# EAGLE design 28vdcEagle (EAGLE 9.6.1)
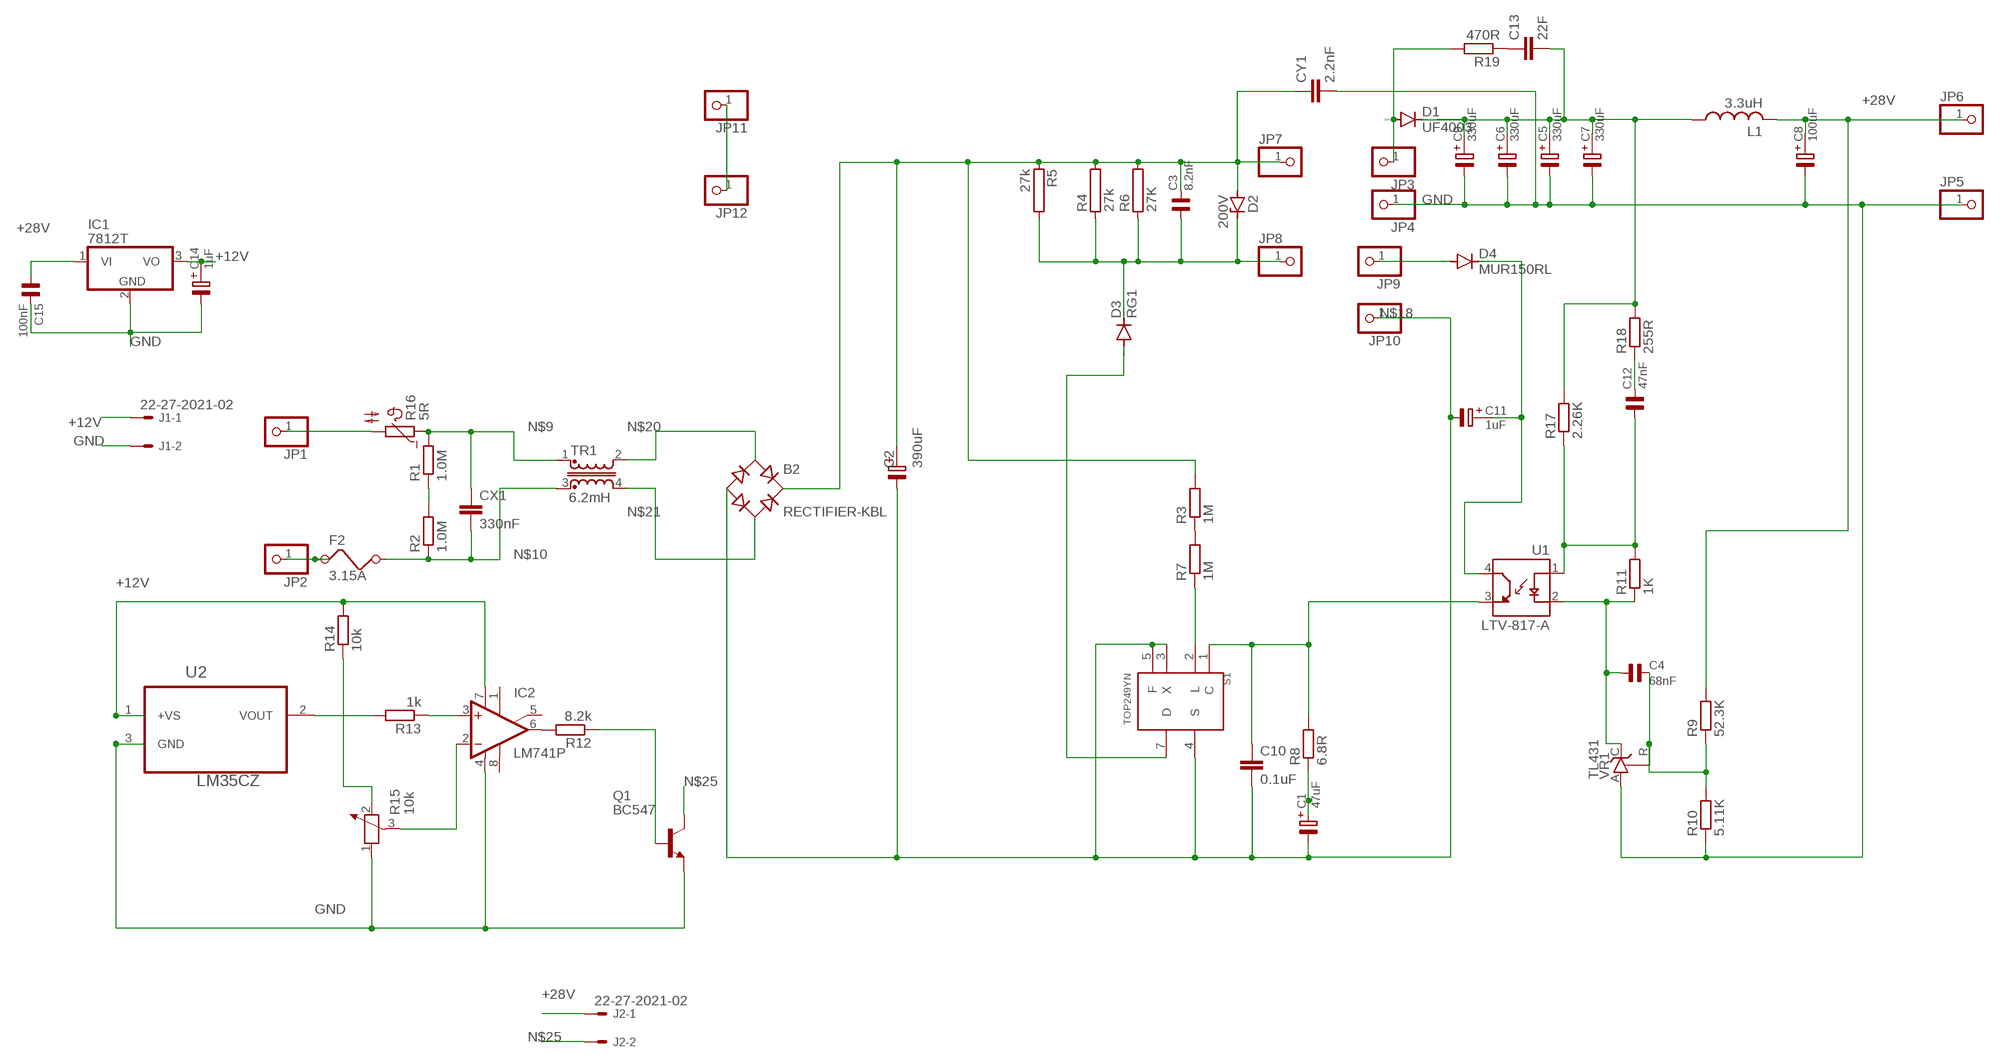
[diagram p0: schematic, sheet 1]

## Parts
B2  RECTIFIER-KBL  [KBL]
C1  47uF  E1,0-3  [E1,0-3]
C2  390uF  E3,5-10  [E3,5-10]
C3  8.2nF  C14,5  [C14,5]
C4  68nF  C2,5  [C2,5]
C5  330uF  E2,0-5  [E2,0-5]
C6  330uF  E2,0-5  [E2,0-5]
C7  330uF  E2,0-5  [E2,0-5]
C8  100uF  E2,0-5  [E2,0-5]
C9  330uF  E2,0-5  [E2,0-5]
C10  0.1uF  C-EU025-030X050  [C025-030X050]
C11  1uF  E1,0-3  [E1,0-3]
C12  47nF  C2,5  [C2,5]
C13  22F  C-EU025-030X050  [C025-030X050]
C14  1uF  E1,0-3  [E1,0-3]
C15  100nF  C2,5  [C2,5]
CX1  330nF  CXXC15B10  [XC15B10]
CY1  2.2nF  CYYC7B5  [YC7B5]
D1  UF4003  [DO41-10]
D2  200V  ZENER-DIODEC1702-15  [C1702-15]
D3  RG1  [DO204-10]
D4  MUR150RL  [DO41-10]
F2  3.15A  FUSE  [FUSE]
IC1  7812T  [TO220H]
IC2  LM741P  [DIL08]
J1  22-27-2021-02  [6410-02]
J2  22-27-2021-02  [6410-02]
JP1  PINHD-1X1  [1X01]
JP2  PINHD-1X1  [1X01]
JP3  PINHD-1X1  [1X01]
JP4  PINHD-1X1  [1X01]
JP5  PINHD-1X1  [1X01]
JP6  PINHD-1X1  [1X01]
JP7  PINHD-1X1  [1X01]
JP8  PINHD-1X1  [1X01]
JP9  PINHD-1X1  [1X01]
JP10  PINHD-1X1  [1X01]
JP11  PINHD-1X1  [1X01]
JP12  PINHD-1X1  [1X01]
L1  3.3uH  L-US0207/10  [0207/10]
Q1  BC547  [TO92]
R1  1.0M  R-EU_0207/10  [0207/10]
R2  1.0M  R-EU_0207/10  [0207/10]
R3  1M  R-EU_0207/10  [0207/10]
R4  27k  RKP290  [KP290]
R5  27k  RKP290  [KP290]
R6  27K  RKP290  [KP290]
R7  1M  R-EU_0207/10  [0207/10]
R8  6.8R  R-EU_0207/10  [0207/10]
R9  52.3K  R-EU_0207/10  [0207/10]
R10  5.11K  R-EU_0207/10  [0207/10]
R11  1K  R-EU_0207/10  [0207/10]
R12  8.2k  R-EU_0207/10  [0207/10]
R13  1k  R-EU_0207/10  [0207/10]
R14  10k  R-EU_0207/10  [0207/10]
R15  10k  POTENTIOMETER_PT-10  [PT-10]
R16  5R  B57164  [B57164]
R17  2.26K  R-EU_0207/10  [0207/10]
R18  255R  R-EU_0207/10  [0207/10]
R19  470R  R-EU_0207/10  [0207/10]
S1  TOP249YN  [TO127P470X1029X2061-7P]
TR1  6.2mH  U15-TRANSFORMER  [U15]
U1  LTV-817-A  [DIP762W50P254L510H500Q4]
U2  LM35CZ  [TO127P254X495-3P]
VR1  TL431  TL431CLP  [TO92-CLP]

## Nets
+12V: C14.+ IC1.3(VO) IC2.7(V+) J1.1 R14.2 U2.1(+VS)
+28V: C8.+ C15.1 IC1.1(VI) J2.1 JP6.1 L1.2 R9.2
GND: C5.- C6.- C7.- C8.- C9.- C14.- C15.2 CY1.2 IC1.2(GND) IC2.4(V-) J1.2 JP4.1 JP5.1 Q1.1(E) R10.1 R15.1 U2.3(GND) VR1.A
N$1: R1.1 R2.2
N$2: B2.+ C2.+ C3.2 CY1.1 D2.A JP7.1 R3.2 R4.2 R5.1 R6.2
N$3: C11.+ D4.C U1.4(CT)
N$4: R3.1 R7.2
N$5: R7.1 S1.2(L)
N$6: IC2.6(OUT) R12.2
N$7: D3.A S1.7(D)
N$8: C3.1 D2.C D3.C JP8.1 R4.1 R5.2 R6.1
N$9: CX1.1 R1.2 R16.1 TR1.1
N$10: CX1.2 F2.2 R2.1 TR1.3
N$11: C4.2 R9.1 R10.2 VR1.R
N$12: C4.1 R11.1 U1.2(C) VR1.C
N$13: C12.1 R11.2 R17.1 U1.1(A)
N$14: C5.+ C6.+ C7.+ C9.+ C13.2 D1.C L1.1 R17.2 R18.2
N$15: JP11.1 JP12.1
N$16: C13.1 R19.1
N$17: C10.1 R8.2 S1.1(C) U1.3(ET)
N$18: B2.- C1.- C2.- C10.2 C11.- JP10.1 S1.3(X) S1.4(S) S1.5(F)
N$19: D4.A JP9.1
N$20: B2.AC1 TR1.2
N$21: B2.AC2 TR1.4
N$23: R13.2 U2.2(VOUT)
N$24: Q1.2(B) R12.1
N$25: J2.2 Q1.3(C)
N$26: IC2.3(+IN) R13.1
N$27: JP1.1 R16.2
N$28: R14.1 R15.2
N$29: IC2.2(-IN) R15.3
N$31: C1.+ R8.1
N$32: C12.2 R18.1
N$33: D1.A JP3.1 R19.2
N$34: F2.1 JP2.1
Unconnected: IC2.1(ON1) IC2.5(ON2) IC2.8(OPT)

## Library data of the parts
B2 = rectifier:RECTIFIER-: Rectifier
C1 C11 C14 = cap-pan:E1,0-3
C2 = cap-pan:E3,5-10
C3 = cap-pan:C14,5
C4 C12 C15 = cap-pan:C2,5
C5-C9 = cap-pan:E2,0-5
C10 C13 = rcl:C-EU: CAPACITOR, European symbol; SPICEPREFIX: C
CX1 = rcl:CX: X CAPACITOR for power line; SPICEPREFIX: C
CY1 = rcl:CY: Y CAPACITOR for power line; SPICEPREFIX: C
D1 = diode:UF4003: DIODE ultrafast recovery diode, 200 V rectifier
D2 = diode:ZENER-DIODE: Z-Diode
D3 = diode:RG1: DIODE
D4 = diode:MUR150RL: DIODE
F2 = special:FUSE: FUSE 5 x 20 mm
IC1 = linear:78*: Positive VOLTAGE REGULATOR Source: http://cache.national.com/ds/LM/LM78L05.pdf http://www.fairchildsemi.com/ds/LM/LM7805.pdf
IC2 = linear:*741: OP AMP
J1 J2 = con-molex:22-?-02: CONNECTOR wire to board 2.54 mm (.1 inch) pitch header; MF: MOLEX; OC_FARNELL: unknown; OC_NEWARK: unknown
JP1-JP12 = pinhead:PINHD-1X1: PIN HEADER
L1 = rcl:L-US: INDUCTOR, American symbol; SPICEPREFIX: L
Q1 = transistor-npn:BC547*: NPN Transistor
R1-R3 R7-R14 R17-R19 = rcl:R-EU_: RESISTOR, European symbol; SPICEPREFIX: R
R4-R6 = resistor-power:R: Power Resitor; OC_FARNELL: unknown; OC_NEWARK: unknown
R15 = rcl:POTENTIOMETER_: Potentiometer; SPICEMODEL: POT; SPICEPREFIX: X
R16 = ptc-ntc:B57164: SIEMENS NTC; MPN: B57164K474K52; OC_FARNELL: 9753451; OC_NEWARK: 29M3118
S1 = TOP249YN:TOP249YN: Power Management, switch, AC - DC Converters, Semiconductors and Actives, line, ic; DESCRIPTION: Converter Offline Flyback Topology 66kHz ~ 132kHz TO-220-7C; DIGI-KEY_PART_NUMBER: 596-1080-5-ND; MF: Power Integrations; MP: TOP249YN; PACKAGE: TO-220 Power Integrations
TR1 = inductor-neosid:U15: TRANSFORMER U15; OC_FARNELL: unknown; OC_NEWARK: unknown
U1 = LTV-817-A (1):LTV-817-A: OPTOISOLATR 5KV TRANSISTOR 4-DIP; AVAILABILITY: Unavailable; DESCRIPTION: Optoisolator Transistor Output 5000Vrms 1 Channel 4-DIP; MF: Lite-On Inc.; MP: LTV-817-A; PACKAGE: DIP-4 Lite-On Inc.; PRICE: None
U2 = LM35CZ (1):LM35CZ: IC, TEMPERATURE SENSOR, ± 0.4°C Buy Part <https://snapeda.com/parts/LM35CZ/Texas%20Instruments/view-part/?ref=eda>; AVAILABILITY: Warning; DESCRIPTION: Temperature Sensor Analog, Local -40°C ~ 110°C 10mV/°C TO-92-3; DIGIKEY-PURCHASE-URL: https://snapeda.com/shop?store=DigiKey&id=1038505; MF: Texas Instruments; MP: LM35CZ; PACKAGE: TO-226-3 Texas Instruments; PRICE: None
VR1 = v-reg:TL431CLP: VOLTAGE REGULATOR

## Board
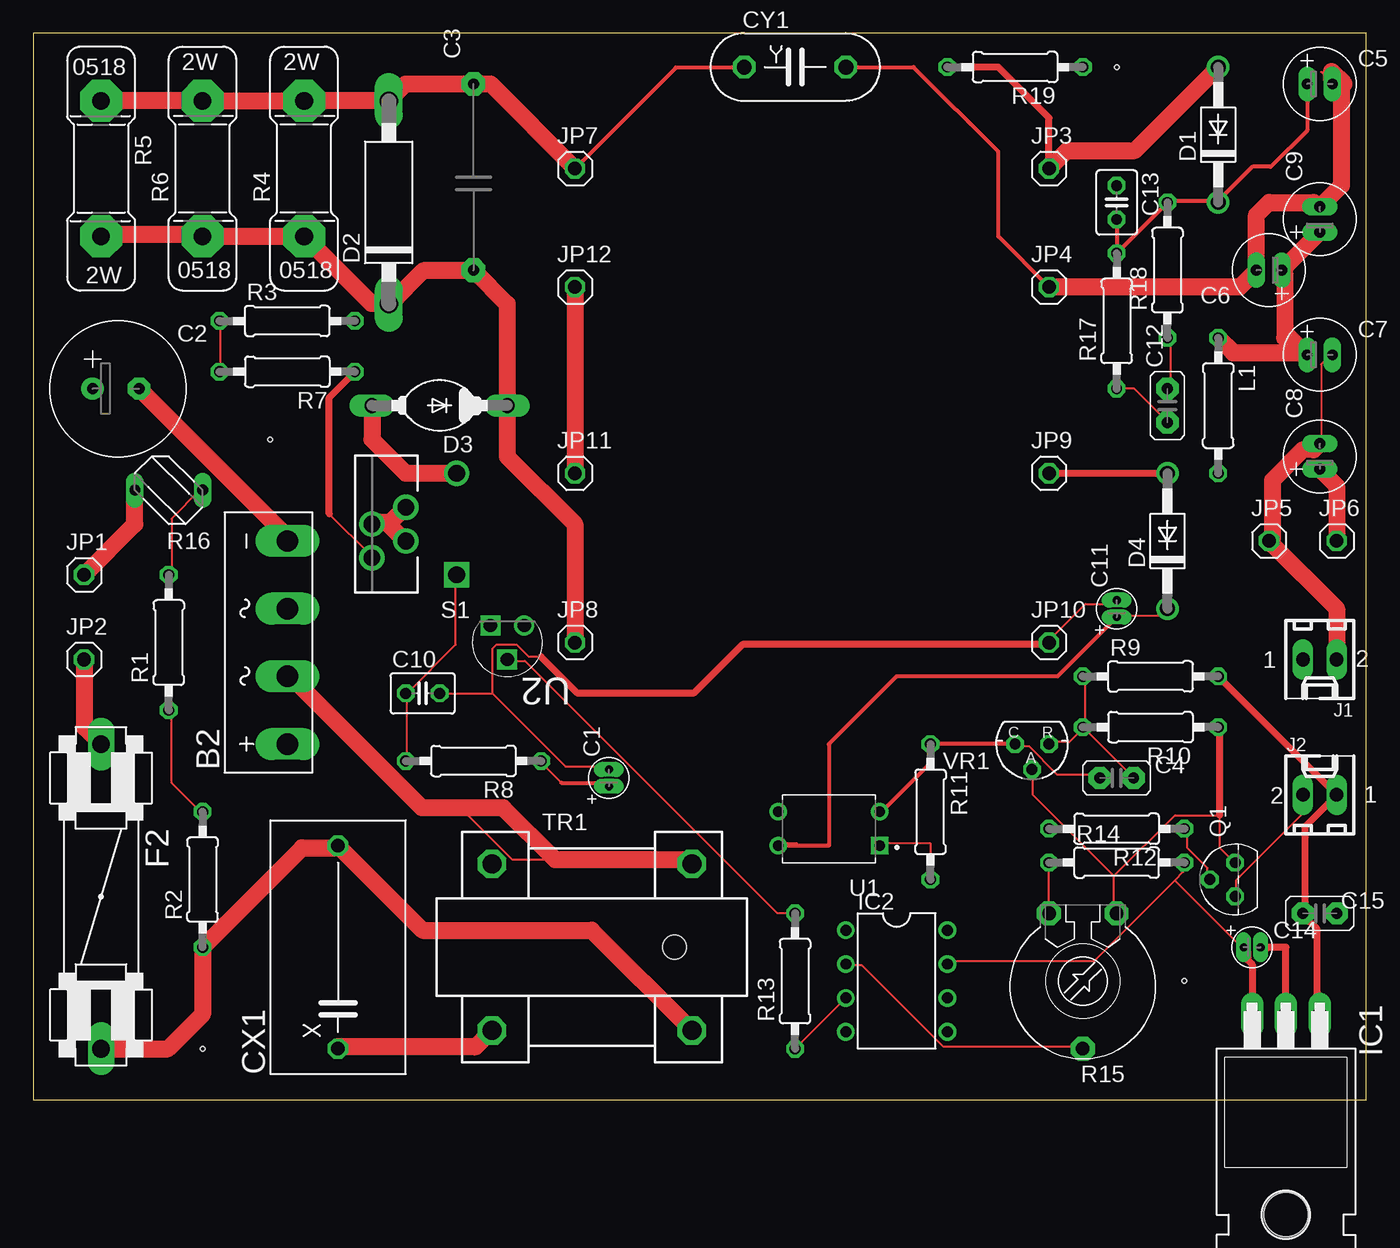
[diagram p1: board, top side]
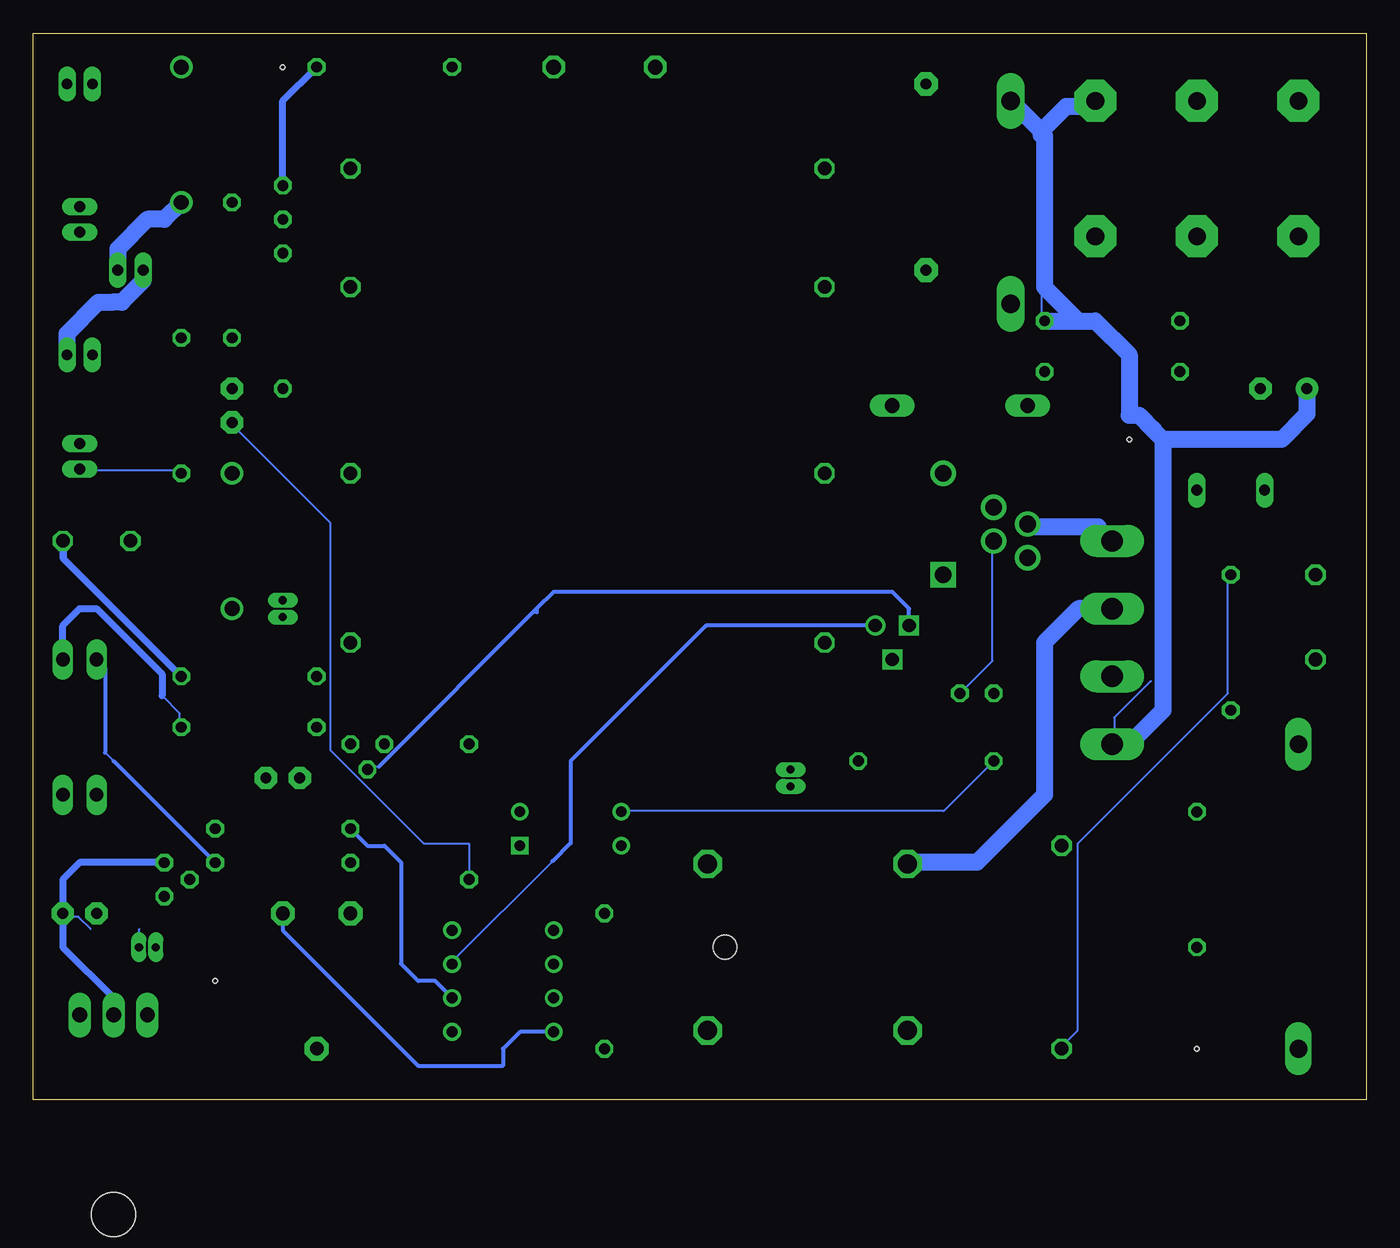
[diagram p2: board, bottom side, seen from below]

Size 100 x 80 mm. Coordinates in mm from the lower left corner, seen from the top.
Outline: 0,0 100,0 100,80 0,80 0,0
Copper layers (1*16): Top 0.035mm / dielectric 1.5mm / Bottom 0.035mm
Design rules "default": minimum track width 6mil, minimum drill 0.35mm, track to track 6mil, track to pad 6mil, pad to pad 6mil, via to via 6mil, smd to smd 6mil, copper to edge 40mil, drill to drill 6mil, minimum pad ring 10mil, minimum via ring 8mil, stop-mask expansion 4mil, vias tented up to drill 0mil, thermal gap 10mil
Holes 0.35 mm at 81.28,77.47 86.36,8.89 12.7,3.81 17.78,49.53

### Footprints (pad centres in the part's own frame; a part is rotated, then mirrored left to right if it is on the bottom)
KBL = drill 1.6 long: + -7.62,-1.27; - 7.62,-1.27; AC1 2.54,-1.27; AC2 -2.54,-1.27
E1,0-3 = drill 0.61 pad 0.965 long: + -0.635,0; - 0.635,0
E3,5-10 = drill 0.813 pad 1.676: + -1.905,0 | drill 0.813 pad 1.676 octagon: - 1.587,0
C14,5 = drill 0.813 pad 1.778 octagon: 1 -6.35,0; 2 7.62,0
C2,5 = drill 0.813 pad 1.676 octagon: 1 -1.27,0; 2 1.27,0
E2,0-5 = drill 0.813 pad 1.27 long: + -0.953,0; - 0.953,0
C025-030X050 = drill 0.813 octagon: 1 -1.27,0; 2 1.27,0
XC15B10 = drill 1.016 octagon: 1 -7.62,0; 2 7.62,0
YC7B5 = drill 1.118 octagon: 1 -3.81,0; 2 3.81,0
DO41-10 = drill 1.118: A 5.08,0; C -5.08,0
C1702-15 = drill 1.397 long: A 7.62,0; C -7.62,0
DO204-10 = drill 1.118 long: A 5.08,0; C -5.08,0
FUSE = drill 1.321 long: 1 -11.43,0; 2 11.43,0
TO220H = drill 1.118 long: 1 -2.54,-10.16; 2 0,-10.16; 3 2.54,-10.16 | hole 3.302: 0,4.826
DIL08 = drill 0.813 pad 1.27: 1 -3.81,-3.81; 2 -1.27,-3.81; 3 1.27,-3.81; 4 3.81,-3.81; 5 3.81,3.81; 6 1.27,3.81; 7 -1.27,3.81; 8 -3.81,3.81
6410-02 = drill 1.016 long: 1 1.27,0; 2 -1.27,0
1X01 = drill 1.016 octagon: 1 0,0
0207/10 = drill 0.813 octagon: 1 -5.08,0; 2 5.08,0
TO92 = drill 0.813 octagon: 1 1.27,0; 2 0,1.905; 3 -1.27,0
KP290 = drill 1.321 pad 3.15 octagon: 1 -5.08,0; 2 5.08,0
PT-10 = drill 1.016 pad 1.778 octagon: 1 -2.54,-5.08; 2 2.54,-5.08; 3 0,5.08
B57164 = drill 0.813 long: 1 -2.54,0; 2 2.54,0
TO127P470X1029X2061-7P = drill 1.25 pad 1.9 square: 1 0,0 | drill 1.25 pad 1.9: 2 6.35,-1.27; 3 3.81,-2.54; 4 6.35,-3.81; 5 3.81,-5.08; 7 0,-7.62
U15 = drill 1.422 octagon: 1 -7.5,-6.25; 2 -7.5,6.25; 3 7.5,-6.25; 4 7.5,6.25 | hole 1.8: 6.2,0
DIP762W50P254L510H500Q4 = drill 0.8 pad 1.2 square: 1 -3.81,1.27 | drill 0.8 pad 1.2: 2 -3.81,-1.27; 3 3.81,-1.27; 4 3.81,1.27
TO127P254X495-3P = drill 0.991: 1 -2.54,-2.54 | drill 0.991 square: 2 -1.27,0; 3 0,-2.54
TO92-CLP = drill 0.813 octagon: A 0,1.905; C 1.27,0; R -1.27,0

### Placement (x,y rotation side)
B2  17.78,34.29 90 top
C1  43.18,24.13 90 top
C2  6.35,53.34 0 top
C3  33.02,68.58 90 top
C4  81.28,24.13 0 top
C5  96.52,76.2 0 top
C6  92.71,62.23 180 top
C7  96.52,55.88 0 top
C8  96.52,48.26 90 top
C9  96.52,66.04 90 top
C10  29.21,30.48 0 top
C11  81.28,36.83 90 top
C12  85.09,52.07 90 top
C13  81.28,67.31 270 top
C14  91.44,11.43 0 top
C15  96.52,13.97 0 top
CX1  22.86,11.43 90 top
CY1  57.15,77.47 0 top
D1  88.9,72.39 90 top
D2  26.67,67.31 90 top
D3  30.48,52.07 180 top
D4  85.09,41.91 90 top
F2  5.08,15.24 270 top
IC1  93.98,-3.81 180 top
IC2  64.77,8.89 270 top
J1  96.52,33.02 180 top
J2  96.52,22.86 0 top
JP1  3.81,39.37 0 top
JP2  3.81,33.02 0 top
JP3  76.2,69.85 0 top
JP4  76.2,60.96 0 top
JP5  92.71,41.91 0 top
JP6  97.79,41.91 0 top
JP7  40.64,69.85 0 top
JP8  40.64,34.29 0 top
JP9  76.2,46.99 0 top
JP10  76.2,34.29 0 top
JP11  40.64,46.99 0 top
JP12  40.64,60.96 0 top
L1  88.9,52.07 270 top
Q1  90.17,16.51 90 top
R1  10.16,34.29 90 top
R2  12.7,16.51 90 top
R3  19.05,58.42 0 top
R4  20.32,69.85 90 top
R5  5.08,69.85 270 top
R6  12.7,69.85 90 top
R7  19.05,54.61 180 top
R8  33.02,25.4 180 top
R9  83.82,31.75 0 top
R10  83.82,27.94 180 top
R11  67.31,21.59 270 top
R12  81.28,20.32 180 top
R13  57.15,8.89 90 top
R14  81.28,17.78 0 top
R15  78.74,8.89 180 top
R16  10.16,45.72 180 top
R17  81.28,58.42 90 top
R18  85.09,62.23 90 top
R19  73.66,77.47 180 top
S1  31.75,39.37 180 top
TR1  41.91,11.43 0 top
U1  59.69,20.32 180 top
U2  34.29,33.02 180 top
VR1  74.93,26.67 180 top

### Tracks (layer width: path | path; a pad name or v marks a point on that pad's centre or on a via)
+12V
  Top 0.152: 85.65,16.46 86.26,17.07 86.26,17.68 R14.2 | 85.65,16.46 79.55,10.36 68.58,10.36 IC2.7 | 85.65,16.46 90.53,11.58 C14.+
  Top 0.508: C14.+ 91.11,11.12 91.11,10.47 91.44,10.14 IC1.3
  Bottom 0.152: 61.06,17.88 68.58,10.36 IC2.7 | 94.61,26.04 93.98,25.4
  Bottom 0.305: U2.1 49.53,35.56 59.69,25.4 59.69,19.25 61.06,17.88 | J1.1 94.61,32.38 94.61,26.04 | 93.98,25.4 R14.2
+28V
  Top 0.152: 95.4,13.72 C15.1 95.4,14.02 95.4,20.73 97.54,22.86 J2.1 97.84,22.86 97.81,22.89
  Top 0.508: R9.2 97.77,22.89 97.81,22.89 | J2.1 95.4,20.47 95.4,13.72 96.32,12.8 96.32,6.55 IC1.1
  Top 1.27: C8.+ 97.79,46.04 JP6.1
  Bottom 0.152: L1.2 89,47.24 96.32,47.24 C8.+ | JP6.1 97.54,41.76 97.54,40.54 89,32 R9.2
  Bottom 0.508: JP6.1 97.79,40.64 R9.2
GND
  Top 0.152: C8.- 96.62,49.38 96.62,55.17 97.23,55.78 C7.- | 96.32,67.06 C9.- 96.62,67.06 96.7,67.13 | 98.15,75.59 96.62,77.11 C5.- | 93.88,6.4 IC1.2 | 89,27.74 R10.1 | Q1.1 89.92,17.98 89,18.9 89,21.34 85.65,21.34 81.08,16.76 | 81.08,16.76 74.98,22.86 74.98,24.69 VR1.A | 81.08,16.76 81.08,14.02 R15.1
  Top 0.305: CY1.2 66.04,77.47 72.39,71.12 72.39,64.77 JP4.1
  Top 0.508: 89,21.34 89,27.74 | C14.- 92.35,11.15 92.63,11.43 93.98,11.43 IC1.2
  Top 1.27: JP4.1 90.53,60.96 91.76,62.19 C6.- 91.76,66.36 92.71,67.31 96.06,67.31 96.32,67.06 | 96.7,67.13 98.15,68.58 98.15,75.59 | C8.- 96.06,48.76 95.26,48.76 92.96,46.46 92.96,42.16 JP5.1 97.79,36.83 J1.2 | C5.- 97.4,77.15 98.35,76.2
  Bottom 0.152: 92.84,61.09 94.11,59.82 | 92.05,12.8 92.05,11.58 C14.- | 90.22,17.68 Q1.1 | 95.71,12.8 96.62,13.72 97.54,13.72 C15.2 | 74.07,24.99 74.68,24.99 VR1.A | 90.35,30.3 89,28.96 89,28.04 R10.1
  Bottom 0.305: 62.48,36.58 62.23,36.58 62.23,36.83 | 74.07,24.99 62.23,36.83 | U2.3 34.29,36.83 35.56,38.1 60.96,38.1 62.23,36.83 | IC2.4 63.5,5.08 64.77,3.81 64.77,2.54 71.12,2.54 81.28,12.7 R15.1
  Bottom 0.508: J1.2 97.79,35.56 96.52,36.83 95.25,36.83 90.35,31.93 90.35,30.3 | Q1.1 96.52,17.78 97.79,16.51 C15.2 | C15.2 97.79,12.7 | C15.2 97.79,11.43 93.98,7.62 IC1.2
  Bottom 1.27: C6.- 91.76,61.43 93.37,59.82 94.11,59.82 95.12,59.82 97.47,57.47 C7.-
N$1
  Top 0.152: R1.1 10.36,28.96 10.36,23.77 12.5,21.64 R2.2
N$2
  Top 0.152: R5.1 5.18,74.98 12.5,74.98 R6.2 12.8,74.98 20.12,74.98 R4.2 | C3.2 28.04,76.2 26.82,74.98 D2.A
  Top 0.305: CY1.1 53.29,77.42 48.21,77.42 JP7.1
  Top 1.27: R5.1 5.13,74.98 12.8,74.98 | R6.2 R4.2 20.37,74.98 26.82,74.98 | D2.A 27.94,76.2 C3.2 34.29,76.2 JP7.1
  Bottom 0.152: 24.38,72.54 24.38,72.39 24.38,58.52 R3.2 24.08,58.22 | 24.38,72.54 26.52,74.68 D2.A | 16.15,31.39 18.9,28.65 18.9,26.82 B2.+ | 22.43,74.5 24.38,72.54
  Bottom 1.27: C2.+ 4.45,51.44 6.35,49.53 15.24,49.53 | 15.24,49.53 15.24,29.21 17.78,26.67 B2.+ | R3.2 21.59,58.42 | 21.59,58.42 20.32,58.42 17.78,55.88 17.78,51.36 17.02,51.36 15.95,50.29 15.95,50.24 15.24,49.53 | D2.A 24.38,72.64 | 24.38,72.64 24.38,72.39 | R4.2 20.75,74.5 22.43,74.5 22.53,74.5 24.38,72.64 | 24.38,72.54 24.13,72.29 24.13,60.96 21.59,58.42
N$3
  Top 0.152: C11.+ 81.38,36.27 84.73,36.27 85.04,36.58 D4.C | 57.3,19.2 56.08,19.2 U1.4
  Top 0.305: C11.+ 76.83,31.75 69.85,31.75 64.77,31.75 59.69,26.67 59.69,19.05 56.24,19.05 56.08,19.2
N$4
  Top 0.152: R7.2 14.02,54.86 14.02,58.22 R3.1
N$5
  Top 0.152: 22.2,43.94 25.3,40.84 S1.2
  Top 0.508: R7.1 22.2,52.68 22.2,43.94
N$6
  Bottom 0.305: IC2.6 69.85,8.89 71.12,8.89 72.42,10.19 72.42,17.8 73.66,19.05 74.93,19.05 R12.2
N$7
  Top 1.27: D3.A 25.4,49.53 27.94,46.99 S1.7
N$8
  Top 0.152: 29.26,62.18 26.82,59.74 D2.C 26.52,59.74 25.3,59.74 20.42,64.62 R4.1 20.12,64.92 12.8,64.92 R6.1 12.5,64.92 5.18,64.92 R5.2
  Top 1.27: R5.2 5.23,64.92 12.8,64.92 | R6.1 20.27,64.77 20.42,64.62 | R4.1 25.35,59.74 26.82,59.74 | D2.C 26.77,59.69 29.26,62.18 32.97,62.18 C3.1 35.56,59.69 D3.C 35.56,48.26 40.64,43.18 JP8.1
N$9
  Top 0.152: R1.2 10.36,39.62 10.36,43.59 12.5,45.72 R16.1 | 33.02,3.96 22.86,3.96 CX1.1
  Top 1.27: TR1.1 33.19,3.96 33.02,3.96 22.86,3.96
  Bottom 0.152: R1.2 10.36,39.32 10.36,30.48 21.64,19.2 21.64,5.18 22.86,3.96 CX1.1
N$10
  Top 0.152: 49.38,5.18 TR1.3 | 22.86,18.9 CX1.2
  Top 1.27: F2.2 10.11,3.81 12.7,6.4 R2.1 20.17,18.9 22.86,18.9 | CX1.2 29.21,12.7 41.89,12.7 TR1.3
N$11
  Top 0.152: VR1.R 76.2,26.82 77.72,26.82 78.64,27.74 R10.2 | R9.1 78.94,31.7 78.94,28.04 R10.2 | R10.2 C4.2
N$12
  Top 0.152: 63.7,21.64 U1.2 | 73.46,26.82 VR1.C 73.76,26.52 74.68,26.52 76.81,24.38 79.86,24.38 C4.1
  Top 0.305: VR1.C R11.1 67.31,25.25 63.7,21.64
N$13
  Top 0.152: U1.1 63.7,19.2 67.31,19.2 R11.2 | R17.1 82.6,53.34 85.04,50.9 C12.1
  Bottom 0.152: R11.2 67.31,19.2 70.71,19.2 77.72,26.21 77.72,43.28 85.04,50.6 C12.1
N$14
  Top 0.152: 93.88,62.48 C6.+ | 93.88,56.08 89.92,56.08 89,57 L1.1 | 93.88,56.08 95.4,56.08 95.44,56.03 C7.+ | 93.88,57.15 93.88,56.08 | 88.77,67.44 88.7,67.36 D1.C
  Top 0.305: D1.C 88.75,67.31 | C5.+ 95.57,72.71 92.84,69.98 91.44,69.98 88.9,67.44 88.77,67.44 85.22,67.44 R18.2 R17.2 C13.2
  Top 1.27: C6.+ 93.88,62.01 93.88,57.15 94.3,57.15 C7.+ | L1.1 90.02,56.03 95.44,56.03 | C9.+ 93.92,62.48 93.88,62.48
  Bottom 1.27: D1.C 90.17,66.04 91.44,66.04 93.66,63.82 C6.+
N$15
  Top 1.27: JP12.1 JP11.1
N$16
  Bottom 0.508: C13.1 81.28,74.93 R19.1
N$17
  Top 0.152: 28.04,30.48 28.04,25.6 R8.2 | 28.04,30.48 31.7,34.14 31.7,39.32 S1.1 | 28.04,30.48 C10.1
  Bottom 0.152: R8.2 31.7,21.64 55.78,21.64 U1.3
N$18
  Top 0.152: 26.52,43.28 26.82,43.28 27.74,44.2 S1.5 | 26.52,43.28 25.6,43.28 S1.4 | 26.64,43.16 26.52,43.28 | C11.- 81.08,37.19 78.94,37.19 76.2,34.44 JP10.1 | 34.44,30.48 39.93,24.99 42.98,24.99 C1.- | C10.2 34.44,30.48 | 38.1,33.22 37.19,33.22 36.27,34.14 34.75,34.14 34.44,33.83 34.44,30.48
  Top 0.508: JP10.1 76.05,34.14 53.19,34.14 49.53,30.48 40.84,30.48 38.1,33.22
  Top 1.27: C2.- 19.05,42.23 B2.- | S1.5 26.77,43.28 25.6,43.28 | S1.3 27.89,41.91 26.64,43.16
  Bottom 0.152: 20.12,42.98 B2.- | C10.2 28.04,32.92 28.04,41.76 S1.3
  Bottom 1.27: S1.4 25.2,42.98 20.12,42.98
N$19
  Top 0.508: JP9.1 D4.A
N$20
  Bottom 0.152: 34.31,17.8 TR1.2
  Bottom 1.27: B2.AC1 21.59,36.83 24.13,34.29 24.13,22.86 29.2,17.8 34.31,17.8
N$21
  Top 0.152: 40.64,17.98 35.97,17.98 32.05,21.89 | 19.2,31.7 B2.AC2
  Top 1.27: TR1.4 49.11,17.98 40.64,17.98 39.17,17.98 35.26,21.89 32.05,21.89 29.16,21.89 19.36,31.7 19.2,31.7
N$23
  Top 0.152: R13.2 57,14.02 55.78,14.02 46.33,23.47 45.7,24.11 36.88,32.92 35.66,32.92 U2.2
N$24
  Top 0.152: R12.1 86.56,20.12 86.56,18.9 88.09,17.37 88.09,16.76 Q1.2
N$25
  Top 0.152: Q1.3 90.22,15.24 90.22,16.46 95.1,21.34 95.1,22.86 J2.2
N$26
  Top 0.152: IC2.3 R13.1
N$27
  Top 1.27: JP1.1 7.62,43.18 R16.2
N$28
  Top 0.152: R15.2 R14.1
N$29
  Top 0.152: IC2.2 60.96,10.06 62.18,10.06 68.28,3.96 78.64,3.96 R15.3
N$31
  Top 0.152: 39.62,23.77 38.1,25.3 R8.1 | 42.98,23.77 C1.+
  Top 0.305: 39.62,23.77 42.98,23.77
N$32
  Top 0.152: R18.1 85.34,56.9 85.34,53.34 C12.2
N$33
  Top 0.508: JP3.1 76.2,73.66 72.39,77.47 R19.2
  Top 1.27: JP3.1 77.55,71.2 82.63,71.2 D1.A
N$34
  Top 1.27: JP2.1 3.81,27.94 F2.1